# Altium schematic sheet rp_usb_connector.SchDoc
size A
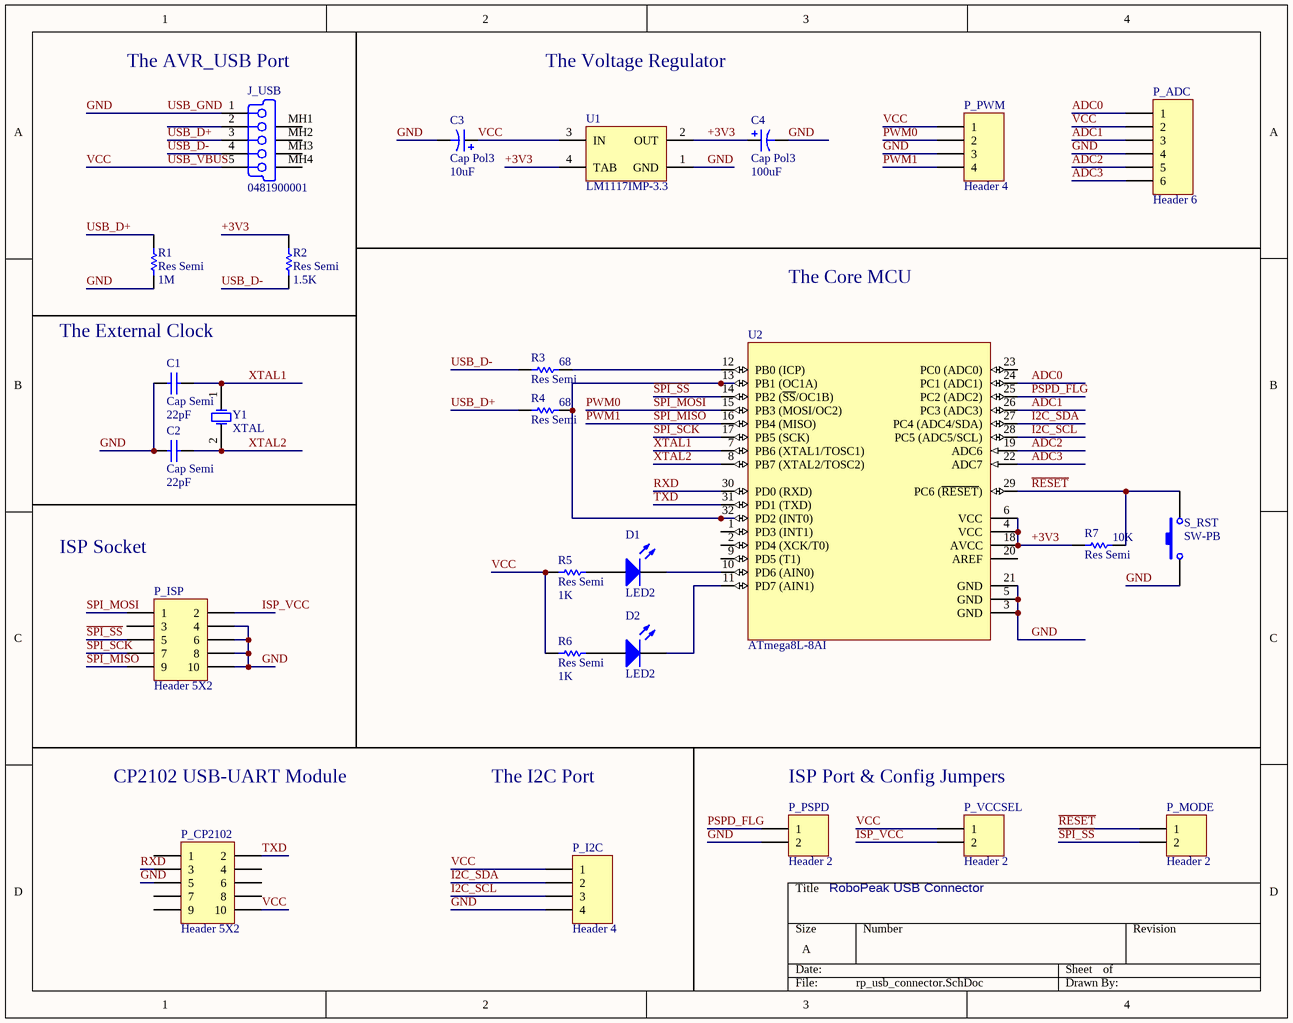
[diagram p0: rp_usb_connector.SchDoc]

## Parts
C1  Cap Semi  value 22pF  [C1206]
C2  Cap Semi  value 22pF  [C1206]
C3  Cap Pol3  value 10uF  [C3528]
C4  Cap Pol3  value 100uF  [C3528]
D1  LED2  [3.2X1.6X1.1]
D2  LED2  [3.2X1.6X1.1]
J_USB  0481900001  [481900001]
P_ADC  Header 6  [HDR1X6]
P_CP2102  Header 5X2  [HDR2X5]
P_I2C  Header 4  [HDR1X4]
P_ISP  Header 5X2  [HDR2X5]
P_MODE  Header 2  [HDR1X2]
P_PSPD  Header 2  [HDR1X2]
P_PWM  Header 4  [HDR1X4]
P_VCCSEL  Header 2  [HDR1X2]
R1  Res Semi  value 1M  [2012[0805]]
R2  Res Semi  value 1.5K  [2012[0805]]
R3  Res Semi  value 68  [2012[0805]]
R4  Res Semi  value 68  [2012[0805]]
R5  Res Semi  value 1K  [2012[0805]]
R6  Res Semi  value 1K  [2012[0805]]
R7  Res Semi  value 10K  [2012[0805]]
S_RST  SW-PB  [SWITCH]
U1  LM1117IMP-3.3  [MP04A_N]
U2  ATmega8L-8AI  [32A_N]
Y1  XTAL  [HC-49U]

## Nets
+3V3: C4.1 R2.2 R7.2 U1.2(OUT) U1.4(TAB) U2.4(VCC) U2.6(VCC) U2.18(AVCC)
ADC0: P_ADC.1 U2.24(PC1_(ADC1))
ADC1: P_ADC.3 U2.26(PC3_(ADC3))
ADC2: P_ADC.5 U2.19(ADC6)
ADC3: P_ADC.6 U2.22(ADC7)
GND: C1.1 C2.1 C3.2 C4.2 J_USB.1(V_BUS_(5V)) P_ADC.4 P_CP2102.5 P_I2C.4 P_ISP.4 P_ISP.6 P_ISP.8 P_ISP.10 P_PSPD.2 P_PWM.3 R1.1 S_RST.1 U1.1(GND) U2.3(GND) U2.5(GND) U2.21(GND)  [also labelled USB_GND]
I2C_SCL: P_I2C.3 U2.28(PC5_(ADC5/SCL))
I2C_SDA: P_I2C.2 U2.27(PC4_(ADC4/SDA))
ISP_VCC: P_ISP.2 P_VCCSEL.2
PSPD_FLG: P_PSPD.1 U2.25(PC2_(ADC2))
PWM0: P_ISP.1 P_PWM.2 U2.15(PB3_(MOSI/OC2))  [also labelled SPI_MOSI]
PWM1: P_ISP.9 P_PWM.4 U2.16(PB4_(MISO))  [also labelled SPI_MISO]
~{RESET}: P_MODE.1 R7.1 S_RST.2 U2.29(PC6_(~{RESET}))
RXD: P_CP2102.3 U2.30(PD0_(RXD))
~{SPI_SS}: P_ISP.5 P_MODE.2 U2.14(PB2_(~{SS}/OC1B))
SPI_SCK: P_ISP.7 U2.17(PB5_(SCK))
TXD: P_CP2102.2 U2.31(PD1_(TXD))
USB_D+: J_USB.3(D+) R1.2 R4.2
USB_D-: J_USB.4(NC) R2.1 R3.2
USB_VBUS: C3.1 J_USB.5(GND) P_ADC.2 P_CP2102.10 P_I2C.1 P_PWM.1 P_VCCSEL.1 R5.1 R6.1 U1.3(IN)  [also labelled VCC]
XTAL1: C1.2 U2.7(PB6_(XTAL1/TOSC1)) Y1.1(OSC1)
XTAL2: C2.2 U2.8(PB7_(XTAL2/TOSC2)) Y1.2(OSC2)
NetD1_1: D1.1(A) R5.2
NetD1_2: D1.2(K) U2.10(PD6_(AIN0))
NetD2_1: D2.1(A) R6.2
NetD2_2: D2.2(K) U2.11(PD7_(AIN1))
NetR3_1: R3.1 U2.12(PB0_(ICP))
NetR4_1: R4.1 U2.13(PB1_(OC1A)) U2.32(PD2_(INT0))

Not connected (* = marked no-connect by the designer): J_USB 2(D-) MH1(Tab) MH2(Tab) MH3(Tab) MH4(Tab); P_CP2102 1 4 6 7 8 9; P_ISP 3; U2 1(PD3_(INT1)) 2(PD4_(XCK/T0)) 9(PD5_(T1)) 20(AREF) 23(PC0_(ADC0))

## Notes on the sheet
- (near J_USB) The AVR_USB Port
- The Voltage Regulator
- The Core MCU
- The External Clock
- ISP Socket
- CP2102 USB-UART Module
- The I2C Port
- ISP Port & Config Jumpers
- RoboPeak USB Connector

## Library data of the parts
C1 C2 = Cap Semi: Capacitor (Semiconductor SIM Model); Published: 8-Jun-2000; LatestRevisionDate: 17-Jul-2002; LatestRevisionNote: Re-released for DXP Platform.; PackageReference: C1206; Publisher: Altium Limited
C3 C4 = Cap Pol3: Polarized Capacitor (Surface Mount); Published: 8-Jun-2000; LatestRevisionDate: 17-Jul-2002; LatestRevisionNote: Re-released for DXP Platform.; PackageReference: C0805; Publisher: Altium Limited
D1 D2 = LED2: Typical RED, GREEN, YELLOW, AMBER GaAs LED; Published: 8-Jun-2000; LatestRevisionDate: 17-Jul-2002; LatestRevisionNote: Re-released for DXP Platform.; PackageDocument: Feb-2002; PackageReference: 3.2X1.6X1.1; Publisher: Altium Limited
J_USB = 0481900001: USB On-The-Go (OTG) Mini-B Receptacle, Right Angle, SMT, 0.80mm (.031") Pitch, Solder Tabs with Back Cover, Recessed Type; PCB_Layout: Complies with Manufacturer's Recommendation.; Published: 21-Sep-2007; DatasheetVersion: revA, May-2004; PackageVersion: May-2004; PackageReference: 481900001; Publisher: Altium Limited; PackageDescription: USB Mini-B, Sinking Type, SM; 5 Position; Right Angle, Body 11.45 x 11.8 x 3.9 mm (LxWxH); ComponentLink1Description: Manufacturer Link; ComponentLink1URL: http://www.molex.com/; ComponentLink2Description: Datasheet; ComponentLink2URL: http://www.molex.com/cmc_upload/0/000/895/958/SD-48190-001RevA.pdf
P_ADC = Header 6: Header, 6-Pin; LatestRevisionDate: 17-Jul-2002; LatestRevisionNote: Re-released for DXP Platform.; Publisher: Altium Limited
P_CP2102 P_ISP = Header 5X2: Header, 5-Pin, Dual row; LatestRevisionDate: 17-Jul-2002; LatestRevisionNote: Re-released for DXP Platform.; Publisher: Altium Limited
P_I2C P_PWM = Header 4: Header, 4-Pin; LatestRevisionDate: 17-Jul-2002; LatestRevisionNote: Re-released for DXP Platform.; Publisher: Altium Limited
P_MODE P_PSPD P_VCCSEL = Header 2: Header, 2-Pin; LatestRevisionDate: 17-Jul-2002; LatestRevisionNote: Re-released for DXP Platform.; Publisher: Altium Limited
R1-R7 = Res Semi: Semiconductor Resistor; Published: 8-Jun-2000; LatestRevisionDate: 17-Jul-2002; LatestRevisionNote: Re-released for DXP Platform.; PackageReference: AXIAL-0.5; Publisher: Altium Limited
S_RST = SW-PB: Switch; Published: 24-Mar-1999; LatestRevisionDate: 17-Jul-2002; LatestRevisionNote: Re-released for DXP Platform.; PackageReference: SPST-2; Publisher: Altium Limited
U1 = LM1117IMP-3.3: 800mA Low-Dropout Linear Regulator; Manufacturer: National Semiconductor; CompType: LDO IC; PackageTopMarking: XYTT*N05B; Published: 27-Nov-2008; DatasheetVersion: Apr-2006; PackageVersion: revB, Apr-2003; PackageReference: MP04A; Publisher: Altium Limited; PackageDescription: Molded SOT-223, 6.50 x 3.56 x 1.6mm Body, 4 Lead, 2.3mm Pitch; PartNumber: LM1117IMP-3.3; RoHS: O; PinCount: 4; DigiKeyPartNumber: LM1117IMP-3.3CT-ND; Code_JEDEC: TO-261-AA; Code_IPC: SOT223-4; ComponentLink1Description: LM1117 Datasheet; ComponentLink1URL: http://www.national.com/ds/LM/LM1117.pdf; ComponentLink2Description: LM1117 Web Page; ComponentLink2URL: http://www.national.com/pf/LM/LM1117.html; ComponentLink3Description: MP04A Package Page; ComponentLink3URL: http://www.national.com/packaging/folders/mp04a.html
U2 = ATmega8L-8AI: 8-Bit AVR Microcontroller with 8K Bytes of In-System Programmable Flash Memory; Published: 17-Sep-2003; LatestRevisionDate: 13-Apr-2006; LatestRevisionNote: IPC-7351 Footprint Added.; DatasheetVersion: 2486H-AVR-09/02; PackageVersion: revB, Oct-2001; PackageReference: 32A; Publisher: Altium Limited; PackageDescription: 32-Pin Thin Quad Flat Pack 0.8 mm Pitch; Code_JEDEC: MS-026-ABA; ComponentLink1Description: Manufacturer Link; ComponentLink1URL: http://www.atmel.com; ComponentLink2Description: Datasheet; ComponentLink2URL: http://www.atmel.com/dyn/resources/prod_documents/doc2486.pdf
Y1 = XTAL: Crystal Oscillator; Published: 8-Jun-2000; LatestRevisionDate: 17-Jul-2002; LatestRevisionNote: Re-released for DXP Platform.; PackageReference: R38; Publisher: Altium Limited